# Altium schematic sheet ADC.SchDoc: ADC
size A2; DrawnBy: Patrik Staudenmayer; DocumentNumber: 10; SheetNumber: 10; SheetTotal: 15
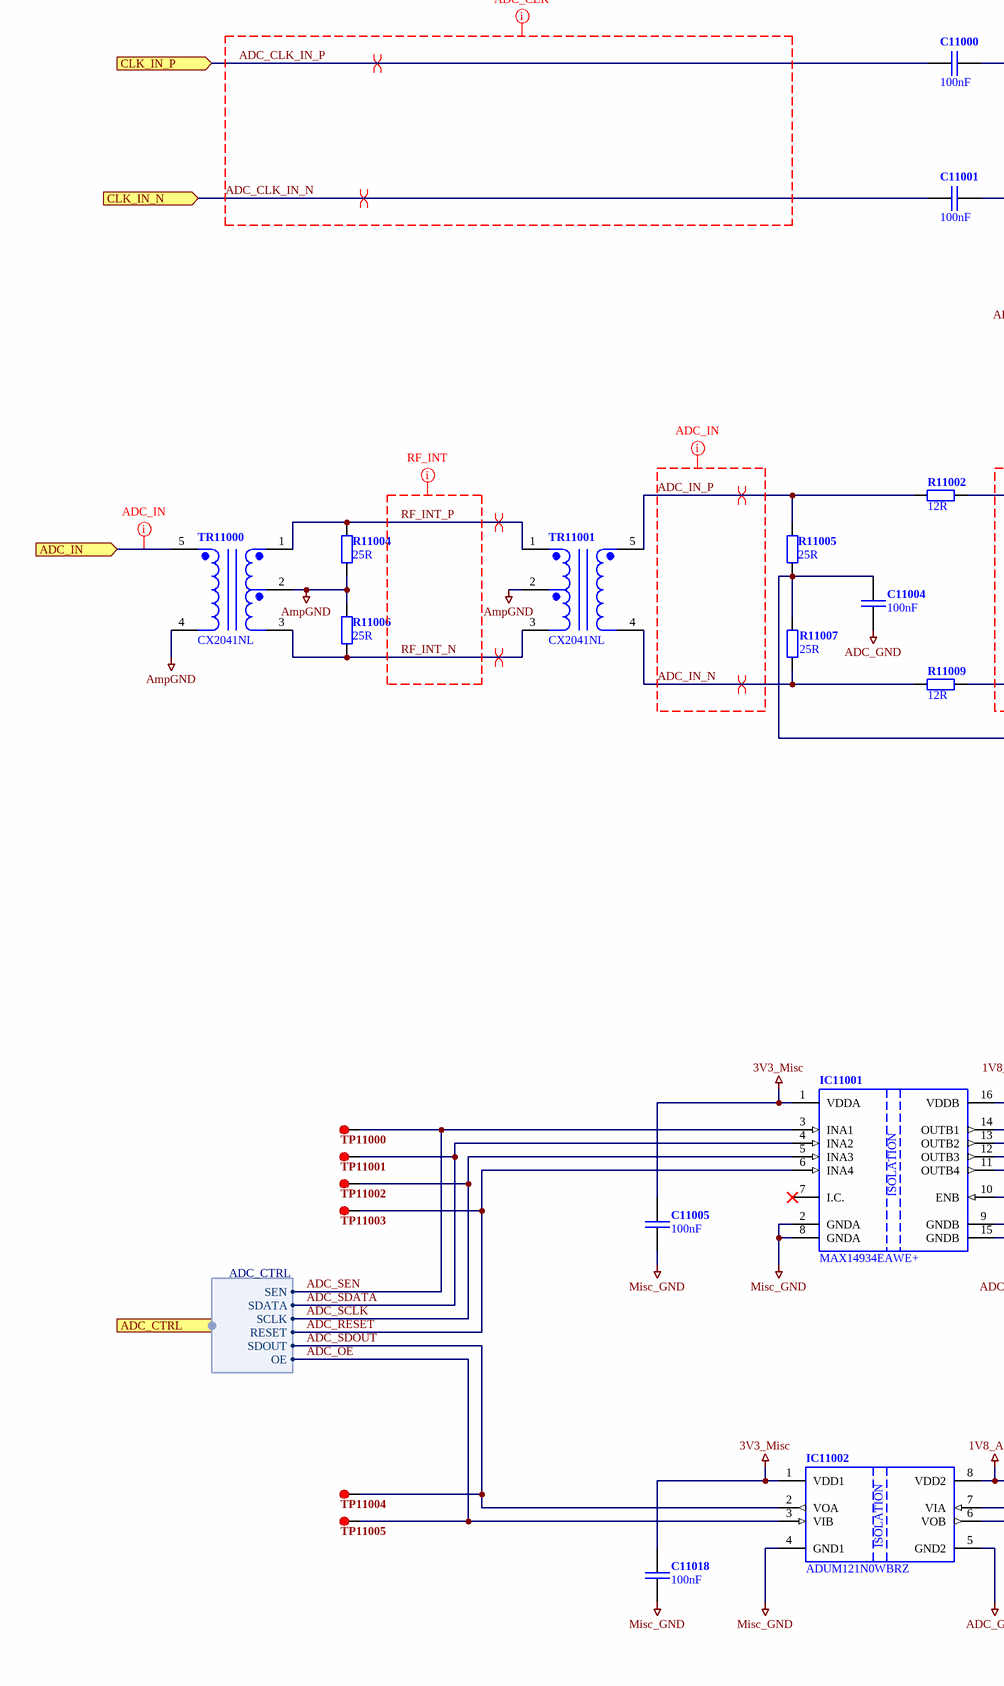
[diagram p0: ADC.SchDoc, left]
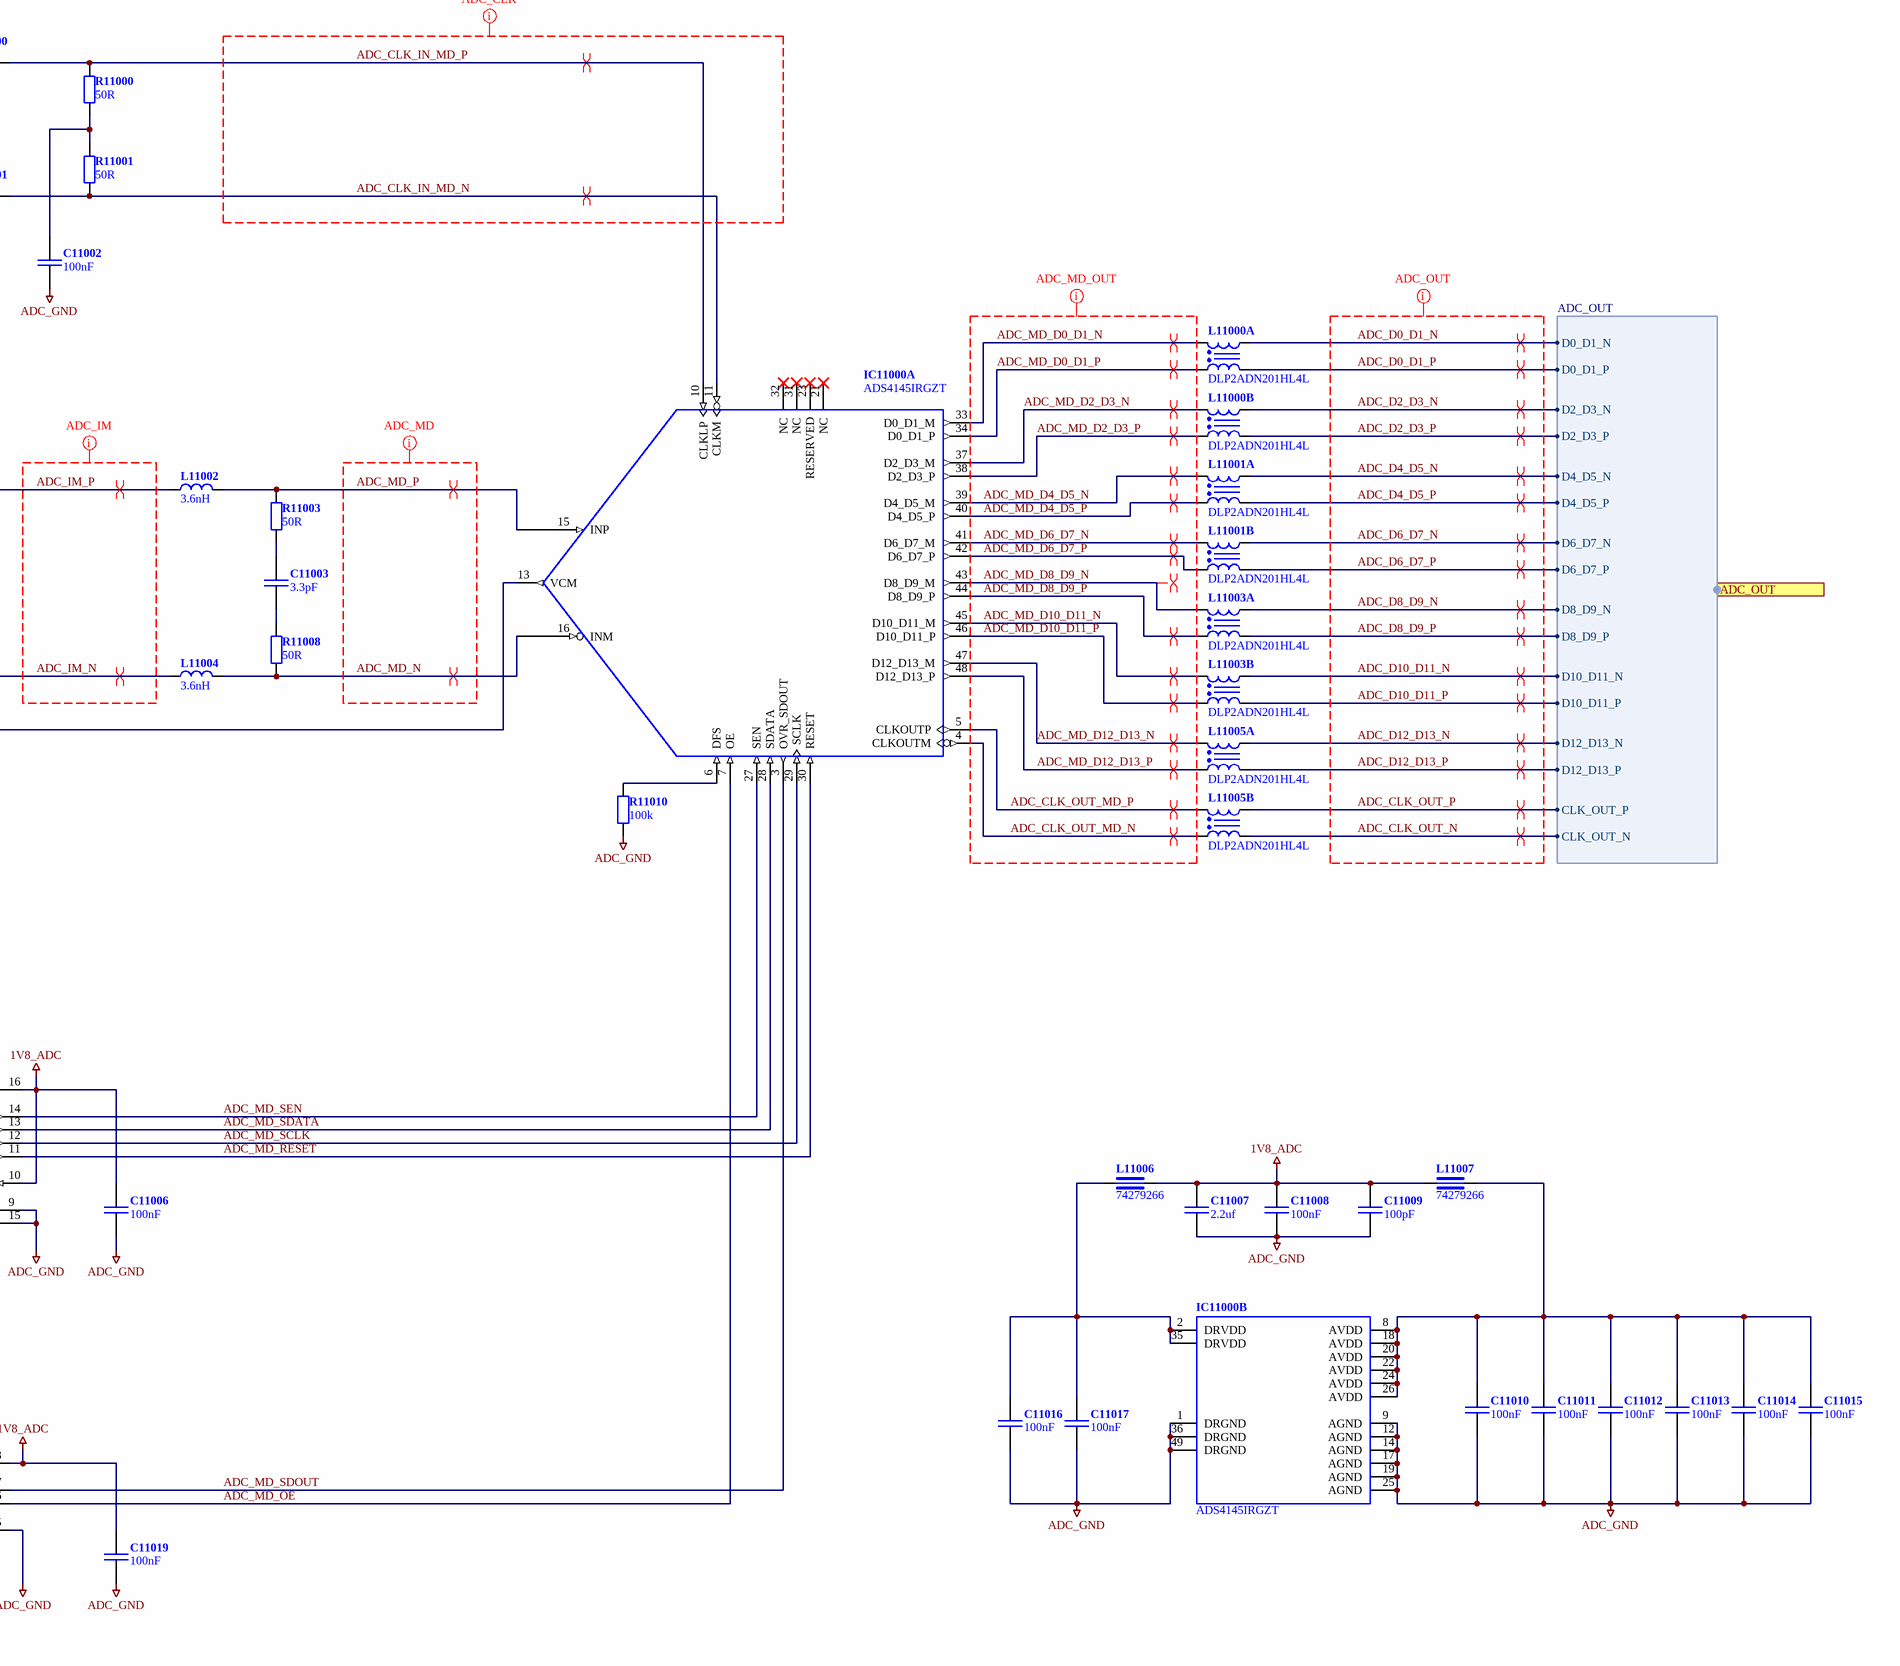
[diagram p1: ADC.SchDoc, right]

## Parts
C11000  100nF  [C_0603_N [CAPC1608N IPC]]
C11001  100nF  [C_0603_N [CAPC1608N IPC]]
C11002  100nF  [C_0603_N [CAPC1608N IPC]]
C11003  3.3pF  [C_0603_N [CAPC1608N IPC]]
C11004  100nF  [C_0603_N [CAPC1608N IPC]]
C11005  100nF  [C_0603_N [CAPC1608N IPC]]
C11006  100nF  [C_0603_N [CAPC1608N IPC]]
C11007  2.2uf  [C_1206_N [CAPC3216N IPC]]
C11008  100nF  [C_0805_N [CAPC2013N IPC]]
C11009  100pF  [C_0603_N [CAPC1608N IPC]]
C11010  100nF  [C_0603_N [CAPC1608N IPC]]
C11011  100nF  [C_0603_N [CAPC1608N IPC]]
C11012  100nF  [C_0603_N [CAPC1608N IPC]]
C11013  100nF  [C_0603_N [CAPC1608N IPC]]
C11014  100nF  [C_0603_N [CAPC1608N IPC]]
C11015  100nF  [C_0603_N [CAPC1608N IPC]]
C11016  100nF  [C_0603_N [CAPC1608N IPC]]
C11017  100nF  [C_0603_N [CAPC1608N IPC]]
C11018  100nF  [C_0603_N [CAPC1608N IPC]]
C11019  100nF  [C_0603_N [CAPC1608N IPC]]
IC11000  ADS4145IRGZT  [QFN50P700X700X100_HS-49N]  (parts A,B of 2)
IC11001  MAX14934EAWE+  [SOIC127P1030X265-16N IPC]
IC11002  ADUM121N0WBRZ  [SOIC127P600X175-8N IPC]
L11000  DLP2ADN201HL4L  [CAF-50P200X100-8N]  (parts A,B of 2)
L11001  DLP2ADN201HL4L  [CAF-50P200X100-8N]  (parts A,B of 2)
L11002  3.6nH  [L_0603_N [INDC1608N IPC]]
L11003  DLP2ADN201HL4L  [CAF-50P200X100-8N]  (parts A,B of 2)
L11004  3.6nH  [L_0603_N [INDC1608N IPC]]
L11005  DLP2ADN201HL4L  [CAF-50P200X100-8N]  (parts A,B of 2)
L11006  74279266  [L_0603_N [INDC1608N IPC]]
L11007  74279266  [L_0603_N [INDC1608N IPC]]
R11000  50R  [R_0603_N [RESC1608N IPC]]
R11001  50R  [R_0603_N [RESC1608N IPC]]
R11002  12R  [R_0603_N [RESC1608N IPC]]
R11003  50R  [R_0603_N [RESC1608N IPC]]
R11004  25R  [R_0603_N [RESC1608N IPC]]
R11005  25R  [R_0603_N [RESC1608N IPC]]
R11006  25R  [R_0603_N [RESC1608N IPC]]
R11007  25R  [R_0603_N [RESC1608N IPC]]
R11008  50R  [R_0603_N [RESC1608N IPC]]
R11009  12R  [R_0603_N [RESC1608N IPC]]
R11010  100k  [R_0603_N [RESC1608N IPC]]
TP11000  TP_GENERIC  [TP_0.8_P100T]  (value not drawn)  (no BOM)
TP11001  TP_GENERIC  [TP_0.8_P100T]  (value not drawn)  (no BOM)
TP11002  TP_GENERIC  [TP_0.8_P100T]  (value not drawn)  (no BOM)
TP11003  TP_GENERIC  [TP_0.8_P100T]  (value not drawn)  (no BOM)
TP11004  TP_GENERIC  [TP_0.8_P100T]  (value not drawn)  (no BOM)
TP11005  TP_GENERIC  [TP_0.8_P100T]  (value not drawn)  (no BOM)
TR11000  CX2041NL  [TR_CX2041NL]
TR11001  CX2041NL  [TR_CX2041NL]

## Ports
ADC_CTRL (out, harness ADC_CTRL), ADC_IN (in), ADC_OUT (out, harness ADC_OUT), CLK_IN_N (in), CLK_IN_P (in)

## Harnesses
ADC_CTRL: SEN, SDATA, SCLK, RESET, SDOUT, OE
ADC_OUT: D0_D1_N, D0_D1_P, D2_D3_N, D2_D3_P, D4_D5_N, D4_D5_P, D6_D7_N, D6_D7_P, D8_D9_N, D8_D9_P, D10_D11_N, D10_D11_P, D12_D13_N, D12_D13_P, CLK_OUT_P, CLK_OUT_N

## Nets
1V8_ADC: C11006.1 C11007.1 C11008.1 C11009.1 C11019.1 IC11001.10(ENB) IC11001.16(VDDB) IC11002.8(VDD2) L11006.2 L11007.2
3V3_Misc: C11005.2 C11018.2 IC11001.1(VDDA) IC11002.1(VDD1)
ADC_GND: C11002.2 C11004.2 C11006.2 C11007.2 C11008.2 C11009.2 C11010.2 C11011.2 C11012.2 C11013.2 C11014.2 C11015.2 C11016.2 C11017.2 C11019.2 IC11000.1(DRGND) IC11000.9(AGND) IC11000.12(AGND) IC11000.14(AGND) IC11000.17(AGND) IC11000.19(AGND) IC11000.25(AGND) IC11000.36(DRGND) IC11000.49(DRGND) IC11001.9(GNDB) IC11001.15(GNDB) IC11002.5(GND2) R11010.1
AmpGND: R11004.1 R11006.2 TR11000.2 TR11000.4 TR11001.2
Misc_GND: C11005.1 C11018.1 IC11001.2(GNDA) IC11001.8(GNDA) IC11002.4(GND1)
ADC_CLK_IN_MD_N: C11001.1 IC11000.11(CLKM) R11001.1
ADC_CLK_IN_MD_P: C11000.1 IC11000.10(CLKLP) R11000.2
ADC_CLK_IN_N: C11001.2 ; port CLK_IN_N
ADC_CLK_IN_P: C11000.2 ; port CLK_IN_P
ADC_CLK_OUT_MD_N: IC11000.4(CLKOUTM) L11005.3
ADC_CLK_OUT_MD_P: IC11000.5(CLKOUTP) L11005.4
ADC_CLK_OUT_N: L11005.6 ; port ADC_OUT.CLK_OUT_N
ADC_CLK_OUT_P: L11005.5 ; port ADC_OUT.CLK_OUT_P
ADC_D0_D1_N: L11000.7 ; port ADC_OUT.D0_D1_N
ADC_D0_D1_P: L11000.8 ; port ADC_OUT.D0_D1_P
ADC_D2_D3_N: L11000.5 ; port ADC_OUT.D2_D3_N
ADC_D2_D3_P: L11000.6 ; port ADC_OUT.D2_D3_P
ADC_D4_D5_N: L11001.7 ; port ADC_OUT.D4_D5_N
ADC_D4_D5_P: L11001.8 ; port ADC_OUT.D4_D5_P
ADC_D6_D7_N: L11001.5 ; port ADC_OUT.D6_D7_N
ADC_D6_D7_P: L11001.6 ; port ADC_OUT.D6_D7_P
ADC_D8_D9_N: L11003.7 ; port ADC_OUT.D8_D9_N
ADC_D8_D9_P: L11003.8 ; port ADC_OUT.D8_D9_P
ADC_D10_D11_N: L11003.5 ; port ADC_OUT.D10_D11_N
ADC_D10_D11_P: L11003.6 ; port ADC_OUT.D10_D11_P
ADC_D12_D13_N: L11005.7 ; port ADC_OUT.D12_D13_N
ADC_D12_D13_P: L11005.8 ; port ADC_OUT.D12_D13_P
ADC_IM_N: L11004.1 R11009.1
ADC_IM_P: L11002.1 R11002.1
ADC_IN: TR11000.5 ; port ADC_IN
ADC_IN_N: R11007.1 R11009.2 TR11001.4
ADC_IN_P: R11002.2 R11005.2 TR11001.5
ADC_MD_D0_D1_N: IC11000.33(D0_D1_M) L11000.2
ADC_MD_D0_D1_P: IC11000.34(D0_D1_P) L11000.1
ADC_MD_D2_D3_N: IC11000.37(D2_D3_M) L11000.4
ADC_MD_D2_D3_P: IC11000.38(D2_D3_P) L11000.3
ADC_MD_D4_D5_N: IC11000.39(D4_D5_M) L11001.2
ADC_MD_D4_D5_P: IC11000.40(D4_D5_P) L11001.1
ADC_MD_D6_D7_N: IC11000.41(D6_D7_M) L11001.4
ADC_MD_D6_D7_P: IC11000.42(D6_D7_P) L11001.3
ADC_MD_D8_D9_N: IC11000.43(D8_D9_M) L11003.2
ADC_MD_D8_D9_P: IC11000.44(D8_D9_P) L11003.1
ADC_MD_D10_D11_N: IC11000.45(D10_D11_M) L11003.4
ADC_MD_D10_D11_P: IC11000.46(D10_D11_P) L11003.3
ADC_MD_D12_D13_N: IC11000.47(D12_D13_M) L11005.2
ADC_MD_D12_D13_P: IC11000.48(D12_D13_P) L11005.1
ADC_MD_N: IC11000.16(INM) L11004.2 R11008.1
ADC_MD_OE: IC11000.7(OE) IC11002.6(VOB)
ADC_MD_P: IC11000.15(INP) L11002.2 R11003.2
ADC_MD_RESET: IC11000.30(RESET) IC11001.11(OUTB4)
ADC_MD_SCLK: IC11000.29(SCLK) IC11001.12(OUTB3)
ADC_MD_SDATA: IC11000.28(SDATA) IC11001.13(OUTB2)
ADC_MD_SDOUT: IC11000.3(OVR_SDOUT) IC11002.7(VIA)
ADC_MD_SEN: IC11000.27(SEN) IC11001.14(OUTB1)
ADC_OE: IC11002.3(VIB) TP11005.1 ; port ADC_CTRL.OE
ADC_RESET: IC11001.6(INA4) TP11003.1 ; port ADC_CTRL.RESET
ADC_SCLK: IC11001.5(INA3) TP11002.1 ; port ADC_CTRL.SCLK
ADC_SDATA: IC11001.4(INA2) TP11001.1 ; port ADC_CTRL.SDATA
ADC_SDOUT: IC11002.2(VOA) TP11004.1 ; port ADC_CTRL.SDOUT
ADC_SEN: IC11001.3(INA1) TP11000.1 ; port ADC_CTRL.SEN
RF_INT_N: R11006.1 TR11000.3 TR11001.3
RF_INT_P: R11004.2 TR11000.1 TR11001.1
NetC11002_1: C11002.1 R11000.1 R11001.2
NetC11003_1: C11003.1 R11003.1
NetC11003_2: C11003.2 R11008.2
NetC11004_1: C11004.1 IC11000.13(VCM) R11005.1 R11007.2
NetC11010_1: C11010.1 C11011.1 C11012.1 C11013.1 C11014.1 C11015.1 IC11000.8(AVDD) IC11000.18(AVDD) IC11000.20(AVDD) IC11000.22(AVDD) IC11000.24(AVDD) IC11000.26(AVDD) L11007.1
NetC11016_1: C11016.1 C11017.1 IC11000.2(DRVDD) IC11000.35(DRVDD) L11006.1
NetIC11000_6: IC11000.6(DFS) R11010.2

Not connected (* = marked no-connect by the designer): IC11000 21(NC)* 23(RESERVED)* 31(NC)* 32(NC)*; IC11001 7(I.C.)*

## Layout directives
differential pair: ADC_CLK_IN_MD_N, ADC_CLK_IN_MD_P, ADC_CLK_IN_N, ADC_CLK_IN_P, ADC_CLK_OUT_MD_N, ADC_CLK_OUT_MD_P, ADC_CLK_OUT_N, ADC_CLK_OUT_P, ADC_D0_D1_N, ADC_D0_D1_P, ADC_D2_D3_N, ADC_D2_D3_P, ADC_D4_D5_N, ADC_D4_D5_P, ADC_D6_D7_N, ADC_D6_D7_P, ADC_D8_D9_N, ADC_D8_D9_P, ADC_D10_D11_N, ADC_D10_D11_P, ADC_D12_D13_N, ADC_D12_D13_P, ADC_IM_N, ADC_IM_P, ADC_IN_N, ADC_IN_P, ADC_MD_D0_D1_N, ADC_MD_D0_D1_P, ADC_MD_D2_D3_N, ADC_MD_D2_D3_P, ADC_MD_D4_D5_N, ADC_MD_D4_D5_P, ADC_MD_D6_D7_N, ADC_MD_D6_D7_P, ADC_MD_D8_D9_N, ADC_MD_D8_D9_P, ADC_MD_D10_D11_N, ADC_MD_D10_D11_P, ADC_MD_D12_D13_N, ADC_MD_D12_D13_P, ADC_MD_N, ADC_MD_P, RF_INT_N, RF_INT_P
net class ADC_IN; rule Differential Pairs Routing [Pref Gap = 5mil    Min Gap  = 5mil    Max Gap  = 5milPref Width = 16.899mil    Min Width  = 14.432mil    Max Width  = 16.899mil]: ADC_IN_N, ADC_IN_P
net class ADC_IM; rule Differential Pairs Routing [Pref Gap = 5mil    Min Gap  = 5mil    Max Gap  = 5milPref Width = 16.899mil    Min Width  = 14.432mil    Max Width  = 16.899mil]: ADC_IM_N, ADC_IM_P
net class ADC_MD; rule Differential Pairs Routing [Pref Gap = 5mil    Min Gap  = 5mil    Max Gap  = 5milPref Width = 16.899mil    Min Width  = 14.432mil    Max Width  = 16.899mil]: ADC_MD_N, ADC_MD_P
net class AD_IM; rule Differential Pairs Routing [Pref Gap = 5mil    Min Gap  = 5mil    Max Gap  = 5milPref Width = 4.138mil    Min Width  = 2.925mil    Max Width  = 4.138mil]; rule Maximum Via Count Constraint [Max Count = 2]; rule Matched Net Lengths [Tolerance = 25mil]: ADC_CLK_IN_N, ADC_CLK_IN_P
rule Maximum Via Count Constraint [Max Count = 2]; rule Differential Pairs Routing [Pref Gap = 5mil    Min Gap  = 5mil    Max Gap  = 5milPref Width = 4.138mil    Min Width  = 2.925mil    Max Width  = 4.138mil]; rule Matched Net Lengths [Tolerance = 25mil]; net class ADC_MD_OUT: ADC_CLK_OUT_MD_N, ADC_CLK_OUT_MD_P, ADC_MD_D0_D1_N, ADC_MD_D0_D1_P, ADC_MD_D2_D3_N, ADC_MD_D2_D3_P, ADC_MD_D4_D5_N, ADC_MD_D4_D5_P, ADC_MD_D6_D7_N, ADC_MD_D6_D7_P, ADC_MD_D8_D9_N, ADC_MD_D8_D9_P, ADC_MD_D10_D11_N, ADC_MD_D10_D11_P, ADC_MD_D12_D13_N, ADC_MD_D12_D13_P
rule Maximum Via Count Constraint [Max Count = 2]; rule Differential Pairs Routing [Pref Gap = 5mil    Min Gap  = 5mil    Max Gap  = 5milPref Width = 4.138mil    Min Width  = 2.925mil    Max Width  = 4.138mil]; rule Matched Net Lengths [Tolerance = 25mil]; net class ADC_OUT: ADC_CLK_OUT_N, ADC_CLK_OUT_P, ADC_D0_D1_N, ADC_D0_D1_P, ADC_D2_D3_N, ADC_D2_D3_P, ADC_D4_D5_N, ADC_D4_D5_P, ADC_D6_D7_N, ADC_D6_D7_P, ADC_D8_D9_N, ADC_D8_D9_P, ADC_D10_D11_N, ADC_D10_D11_P, ADC_D12_D13_N, ADC_D12_D13_P
rule Differential Pairs Routing [Pref Gap = 5mil    Min Gap  = 5mil    Max Gap  = 5milPref Width = 16.899mil    Min Width  = 14.432mil    Max Width  = 16.899mil]; rule Maximum Via Count Constraint [Max Count = 2]; rule Matched Net Lengths [Tolerance = 25mil]; net class RF_INT: RF_INT_N, RF_INT_P
rule Width Constraint [Pref Impedance = 50.00ohms    Min Impedance = 50.00ohms    Max Impedance = 50.00ohms]: ADC_IN
net class ADC_MD; rule Differential Pairs Routing [Pref Gap = 5mil    Min Gap  = 5mil    Max Gap  = 5milPref Width = 4.138mil    Min Width  = 2.925mil    Max Width  = 4.138mil]; rule Maximum Via Count Constraint [Max Count = 2]; rule Matched Net Lengths [Tolerance = 25mil]: ADC_CLK_IN_MD_N, ADC_CLK_IN_MD_P

## Notes on the sheet
- Project:
- Title:
- Size:
- Date:
- File:
- A2
- Project ID:
- Time:
- Sheet
- Version:
- of
- Variant:
- (in symbol IC_ADUM121N0WBRZ) ISOLATION
- (in symbol IC_MAX14934EAWE+) ISOLATION

## Library data of the parts
C11000-C11002 = C_GENERIC: Prometheus_Manufacturer: Yageo; Prometheus_ID: CC0603JRX7R7BB104; Prometheus_ManPartNo: 100nF; Prometheus_Comment: 100nF; Prometheus_CurrentFootprint: C_0603_N [CAPC1608N IPC]
C11003-C11019 = C_GENERIC: Prometheus_ID: *; Prometheus_Manufacturer: *
  C11003: Prometheus_ManPartNo: 3.3pF; Prometheus_Comment: 3.3pF; Prometheus_CurrentFootprint: C_0603_N [CAPC1608N IPC]
  C11004-C11006 C11010-C11019: Prometheus_ManPartNo: 100nF; Prometheus_Comment: 100nF; Prometheus_CurrentFootprint: C_0603_N [CAPC1608N IPC]
  C11007: Prometheus_ManPartNo: 2.2uf; Prometheus_Comment: 2.2uf; Prometheus_CurrentFootprint: C_1206_N [CAPC3216N IPC]
  C11008: Prometheus_ManPartNo: 100nF; Prometheus_Comment: 100nF; Prometheus_CurrentFootprint: C_0805_N [CAPC2013N IPC]
  C11009: Prometheus_ManPartNo: 100pF; Prometheus_Comment: 100pF; Prometheus_CurrentFootprint: C_0603_N [CAPC1608N IPC]
IC11000 = IC_ADS4145IRGZT: 12 Bit, 125 MSPS Ultra-Low-Power ADC / Dynamical Power Scaling with sample rate / Output Interface: / DDR LVDS / Parallel CMOS / 1.8 V Single supply; Prometheus_Manufacturer: Texas Instruments; Prometheus_ManPartNo: ADS4145IRGZT; Prometheus_Comment: ADS4145IRGZT; Prometheus_CurrentFootprint: QFN50P700X700X100_HS-49N; DatasheetURL: https://www.ti.com/lit/ds/symlink/ads4145.pdf
IC11001 = IC_MAX14934EAWE+: High-Speed, Robust-EMC Reinforced Six-Channel Digital Isolators / 100 Mbps data rate / Vcc: 2.25 V ... 5.5 V / 2.25 V to 5.5 V level translation; Prometheus_Manufacturer: Maxim Integrated; Prometheus_ManPartNo: MAX14934EAWE+; Prometheus_Comment: MAX14934EAWE+; Prometheus_CurrentFootprint: SOIC127P1030X265-16N IPC; DatasheetURL: https://datasheets.maximintegrated.com/en/ds/MAX14934-MAX14936.pdf
IC11002 = IC_ADUM121N0WBRZ: 1/1 digital isolator / 1.8 V to 5 V Level translation; Prometheus_Manufacturer: Analog Devices; Prometheus_ManPartNo: ADUM121N0WBRZ; Prometheus_Comment: ADUM121N0WBRZ; Prometheus_CurrentFootprint: SOIC127P600X175-8N IPC; DatasheetURL: https://www.analog.com/media/en/technical-documentation/data-sheets/ADuM120N_121N.pdf
L11000 L11001 L11003 L11005 = L_COMMONMODE_CHOKE_DLP2ADN201HL4L: Prometheus_Manufacturer: Murata Electronics; Prometheus_ID: *; Prometheus_ManPartNo: DLP2ADN201HL4L; Prometheus_Comment: DLP2ADN201HL4L; Prometheus_CurrentFootprint: CAF-50P200X100-8N
L11002 L11004 = L_GENERIC: Prometheus_ManPartNo: 744917036; Prometheus_Manufacturer: Wuerth Electronics; Prometheus_ID: *; Prometheus_Comment: 3.6nH; Prometheus_CurrentFootprint: L_0603_N [INDC1608N IPC]
L11006 L11007 = FB_GENERIC: 1 kOHM @ 100 MHz / 200 mA max.; Prometheus_ID: *; Prometheus_ManPartNo: 74279266; Prometheus_Manufacturer: *; Prometheus_Comment: 74279266; Prometheus_CurrentFootprint: L_0603_N [INDC1608N IPC]
R11000-R11010 = R_GENERIC_DIN: Prometheus_ID: *; Prometheus_Manufacturer: *; Prometheus_CurrentFootprint: R_0603_N [RESC1608N IPC]
  R11000 R11001 R11003 R11008: Prometheus_ManPartNo: 50R; Prometheus_Comment: 50R
  R11002 R11009: Prometheus_ManPartNo: 12R; Prometheus_Comment: 12R
  R11004-R11007: Prometheus_ManPartNo: 25R; Prometheus_Comment: 25R
  R11010: Prometheus_ManPartNo: 100k; Prometheus_Comment: 100k
TP11000-TP11005 = TP_GENERIC: Needle Test Point; Prometheus_ID: *; Prometheus_ManPartNo: TP_GENERIC; Prometheus_Manufacturer: *; Prometheus_Comment: TP_GENERIC; Prometheus_CurrentFootprint: TP_0.8_P100T
TR11000 TR11001 = TR_CX2041NL: Balun / 1:1 with center tap / 3 dB Bandwidth: 0.05 MHz to 450 MHz; Prometheus_Manufacturer: Pulse Engineering; Prometheus_ID: *; Prometheus_ManPartNo: CX2041NL; Prometheus_Comment: CX2041NL; Prometheus_CurrentFootprint: TR_CX2041NL